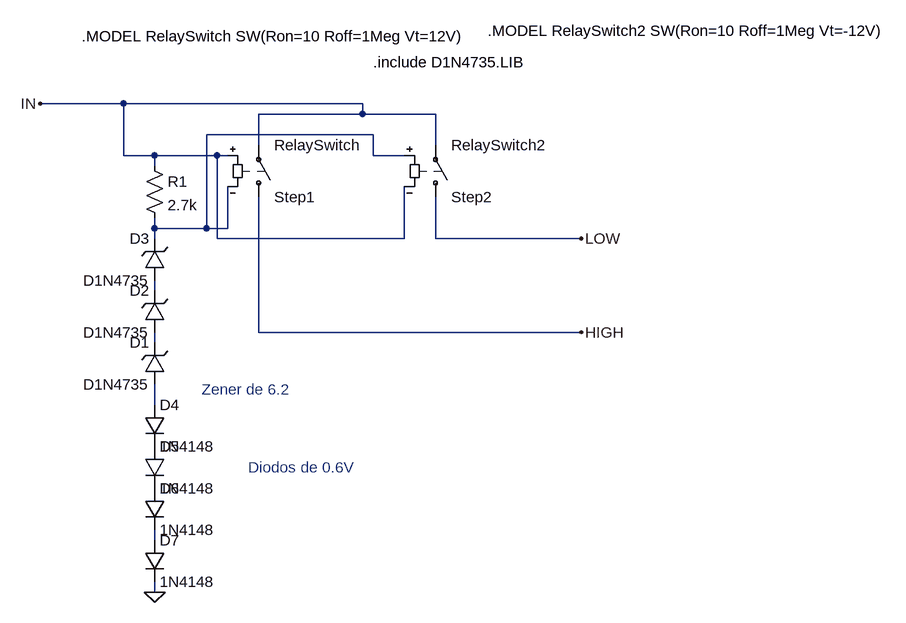
[diagram p0: schematic Relay.asc]
Relay.asc, the LTspice schematic file:
Version 4
SHEET 1 960 724
WIRE -224 -48 -352 -48
WIRE 144 -48 -224 -48
WIRE 144 -32 144 -48
WIRE 144 -32 -16 -32
WIRE 256 -32 144 -32
WIRE 160 0 -96 0
WIRE -16 16 -16 -32
WIRE 256 16 256 -32
WIRE -224 32 -224 -48
WIRE -176 32 -224 32
WIRE -80 32 -176 32
WIRE -64 32 -80 32
WIRE 160 32 160 0
WIRE 208 32 160 32
WIRE -176 48 -176 32
WIRE -176 144 -176 128
WIRE -96 144 -96 0
WIRE -96 144 -176 144
WIRE -64 144 -64 80
WIRE -64 144 -96 144
WIRE -176 160 -176 144
WIRE -80 160 -80 32
WIRE 208 160 208 80
WIRE 208 160 -80 160
WIRE 256 160 256 96
WIRE 480 160 256 160
WIRE -176 240 -176 224
WIRE -16 304 -16 96
WIRE 480 304 -16 304
WIRE -176 320 -176 304
WIRE -176 416 -176 384
WIRE -176 624 -176 608
WIRE -176 704 -176 688
FLAG -176 704 0
FLAG -352 -48 IN
FLAG 480 160 LOW
FLAG 480 304 HIGH
SYMBOL sw -16 112 M180
SYMATTR InstName Step1
SYMATTR Value RelaySwitch
SYMBOL sw 256 112 M180
SYMATTR InstName Step2
SYMATTR Value RelaySwitch2
SYMBOL zener -160 384 R180
WINDOW 0 24 64 Left 2
WINDOW 3 24 0 Left 2
SYMATTR InstName D1
SYMATTR Value D1N4735
SYMBOL zener -160 304 R180
WINDOW 0 24 64 Left 2
WINDOW 3 24 0 Left 2
SYMATTR InstName D2
SYMATTR Value D1N4735
SYMBOL res -192 32 R0
SYMATTR InstName R1
SYMATTR Value 2.7k
SYMBOL zener -160 224 R180
WINDOW 0 24 64 Left 2
WINDOW 3 24 0 Left 2
SYMATTR InstName D3
SYMATTR Value D1N4735
SYMBOL diode -192 416 R0
SYMATTR InstName D4
SYMATTR Value 1N4148
SYMBOL diode -192 480 R0
SYMATTR InstName D5
SYMATTR Value 1N4148
SYMBOL diode -192 544 R0
SYMATTR InstName D6
SYMATTR Value 1N4148
SYMBOL diode -192 624 R0
SYMATTR InstName D7
SYMATTR Value 1N4148
TEXT -104 392 Left 2 ;Zener de 6.2
TEXT -288 -152 Left 2 !.MODEL RelaySwitch SW(Ron=10 Roff=1Meg Vt=12V)
TEXT 160 -112 Left 2 !.include D1N4735.LIB
TEXT 336 -160 Left 2 !.MODEL RelaySwitch2 SW(Ron=10 Roff=1Meg Vt=-12V)
TEXT -32 512 Left 2 ;Diodos de 0.6V

The netlist it stands for:
* Relay.asc
Step1 HIGH IN IN N001 RelaySwitch
Step2 LOW IN N001 IN RelaySwitch2
D1 N004 N003 D1N4735
D2 N003 N002 D1N4735
R1 IN N001 2.7k
D3 N002 N001 D1N4735
D4 N004 P001 1N4148
D5 P001 P002 1N4148
D6 P002 N005 1N4148
D7 N005 0 1N4148
.model D D
.lib standard.dio
* Zener de 6.2
.MODEL RelaySwitch SW(Ron=10 Roff=1Meg Vt=12V)
.include D1N4735.LIB
.MODEL RelaySwitch2 SW(Ron=10 Roff=1Meg Vt=-12V)
* Diodos de 0.6V
.backanno
.end